# Altium schematic sheet Block_Diagram.SchDoc
size A4; Organization: Altium Limited; Address1: L3, 12a Rodborough Rd; Address2: Frenchs Forest; Address3: NSW; Address4: Australia 2086; SheetNumber: 1; SheetTotal: 2
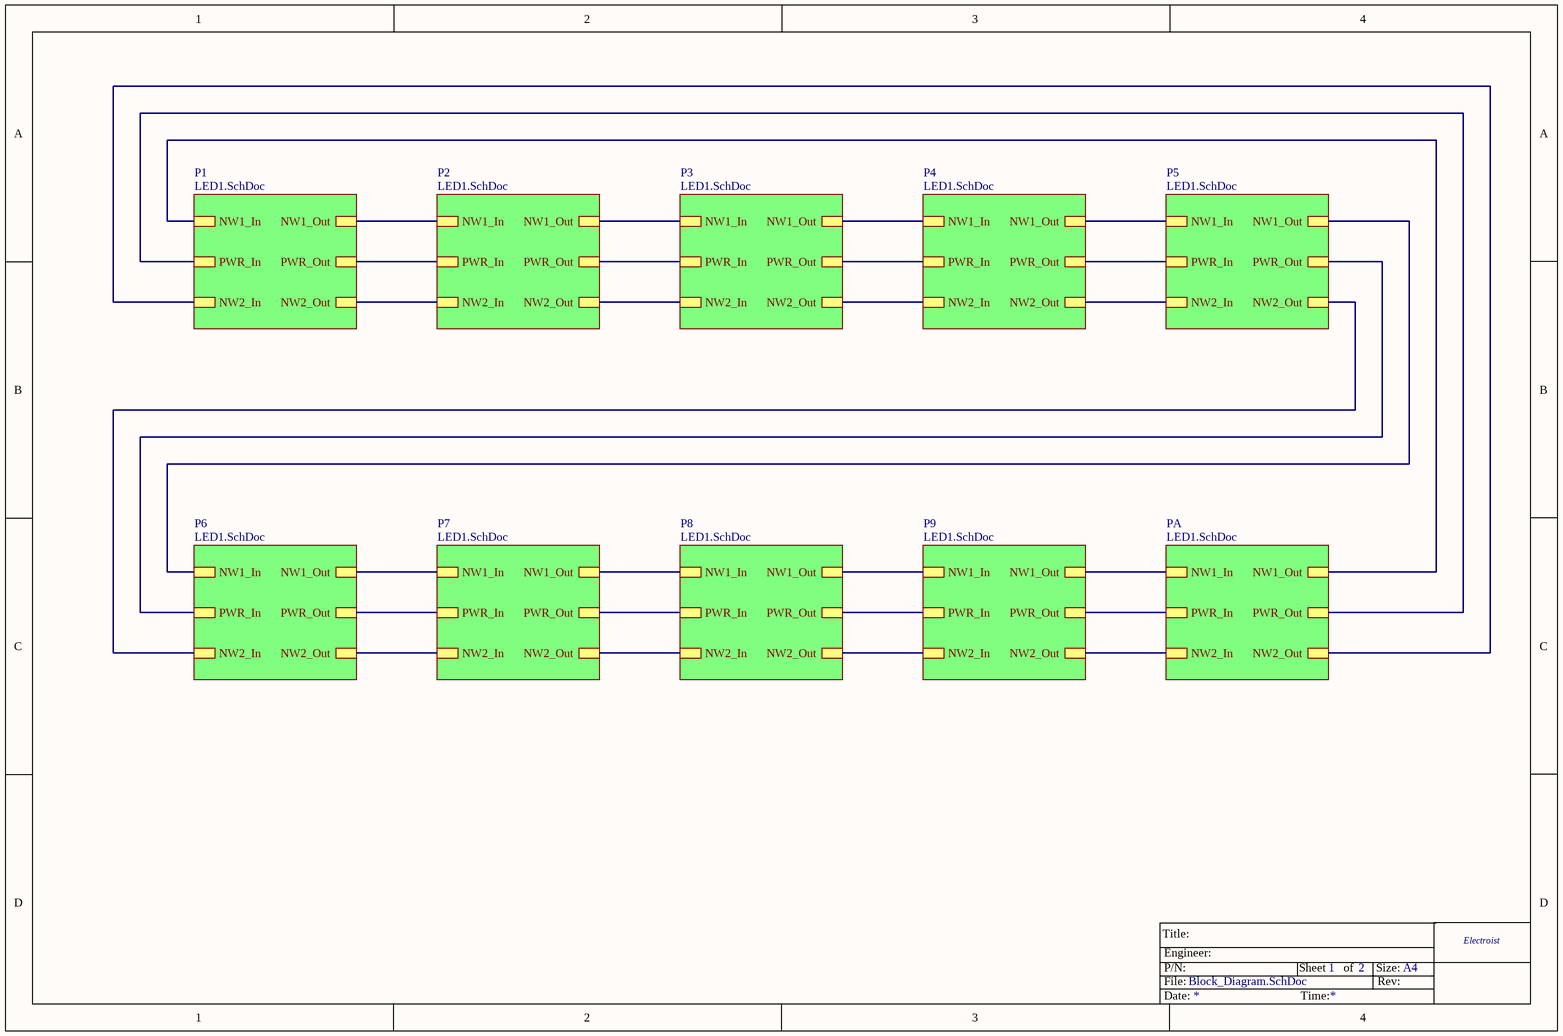
[diagram p0: Block_Diagram.SchDoc]

## Sub-sheets
P1 = LED1.SchDoc: NW1_In, NW1_Out, NW2_In, NW2_Out, PWR_In, PWR_Out
P2 = LED1.SchDoc: NW1_In, NW1_Out, NW2_In, NW2_Out, PWR_In, PWR_Out
P3 = LED1.SchDoc: NW1_In, NW1_Out, NW2_In, NW2_Out, PWR_In, PWR_Out
P4 = LED1.SchDoc: NW1_In, NW1_Out, NW2_In, NW2_Out, PWR_In, PWR_Out
P5 = LED1.SchDoc: NW1_In, NW1_Out, NW2_In, NW2_Out, PWR_In, PWR_Out
P6 = LED1.SchDoc: NW1_In, NW1_Out, NW2_In, NW2_Out, PWR_In, PWR_Out
P7 = LED1.SchDoc: NW1_In, NW1_Out, NW2_In, NW2_Out, PWR_In, PWR_Out
P8 = LED1.SchDoc: NW1_In, NW1_Out, NW2_In, NW2_Out, PWR_In, PWR_Out
P9 = LED1.SchDoc: NW1_In, NW1_Out, NW2_In, NW2_Out, PWR_In, PWR_Out
PA = LED1.SchDoc: NW1_In, NW1_Out, NW2_In, NW2_Out, PWR_In, PWR_Out

## Nets
(unnamed): sheet P1/NW1_In, sheet PA/NW1_Out
(unnamed): sheet P1/NW1_Out, sheet P2/NW1_In
(unnamed): sheet P1/NW2_In, sheet PA/NW2_Out
(unnamed): sheet P1/NW2_Out, sheet P2/NW2_In
(unnamed): sheet P1/PWR_In, sheet PA/PWR_Out
(unnamed): sheet P1/PWR_Out, sheet P2/PWR_In
(unnamed): sheet P2/NW1_Out, sheet P3/NW1_In
(unnamed): sheet P2/NW2_Out, sheet P3/NW2_In
(unnamed): sheet P2/PWR_Out, sheet P3/PWR_In
(unnamed): sheet P3/NW1_Out, sheet P4/NW1_In
(unnamed): sheet P3/NW2_Out, sheet P4/NW2_In
(unnamed): sheet P3/PWR_Out, sheet P4/PWR_In
(unnamed): sheet P4/NW1_Out, sheet P5/NW1_In
(unnamed): sheet P4/NW2_Out, sheet P5/NW2_In
(unnamed): sheet P4/PWR_Out, sheet P5/PWR_In
(unnamed): sheet P5/NW1_Out, sheet P6/NW1_In
(unnamed): sheet P5/NW2_Out, sheet P6/NW2_In
(unnamed): sheet P5/PWR_Out, sheet P6/PWR_In
(unnamed): sheet P6/NW1_Out, sheet P7/NW1_In
(unnamed): sheet P6/NW2_Out, sheet P7/NW2_In
(unnamed): sheet P6/PWR_Out, sheet P7/PWR_In
(unnamed): sheet P7/NW1_Out, sheet P8/NW1_In
(unnamed): sheet P7/NW2_Out, sheet P8/NW2_In
(unnamed): sheet P7/PWR_Out, sheet P8/PWR_In
(unnamed): sheet P8/NW1_Out, sheet P9/NW1_In
(unnamed): sheet P8/NW2_Out, sheet P9/NW2_In
(unnamed): sheet P8/PWR_Out, sheet P9/PWR_In
(unnamed): sheet P9/NW1_Out, sheet PA/NW1_In
(unnamed): sheet P9/NW2_Out, sheet PA/NW2_In
(unnamed): sheet P9/PWR_Out, sheet PA/PWR_In

## Notes on the sheet
- Title:
- File:
- P/N:
- Engineer:
- Sheet
- of
- Size:
- Rev:
- A4
- Electroist
- Date:
- Time: